# EAGLE schematic LCDShieldC144MVGD v1 (EAGLE 5.11)
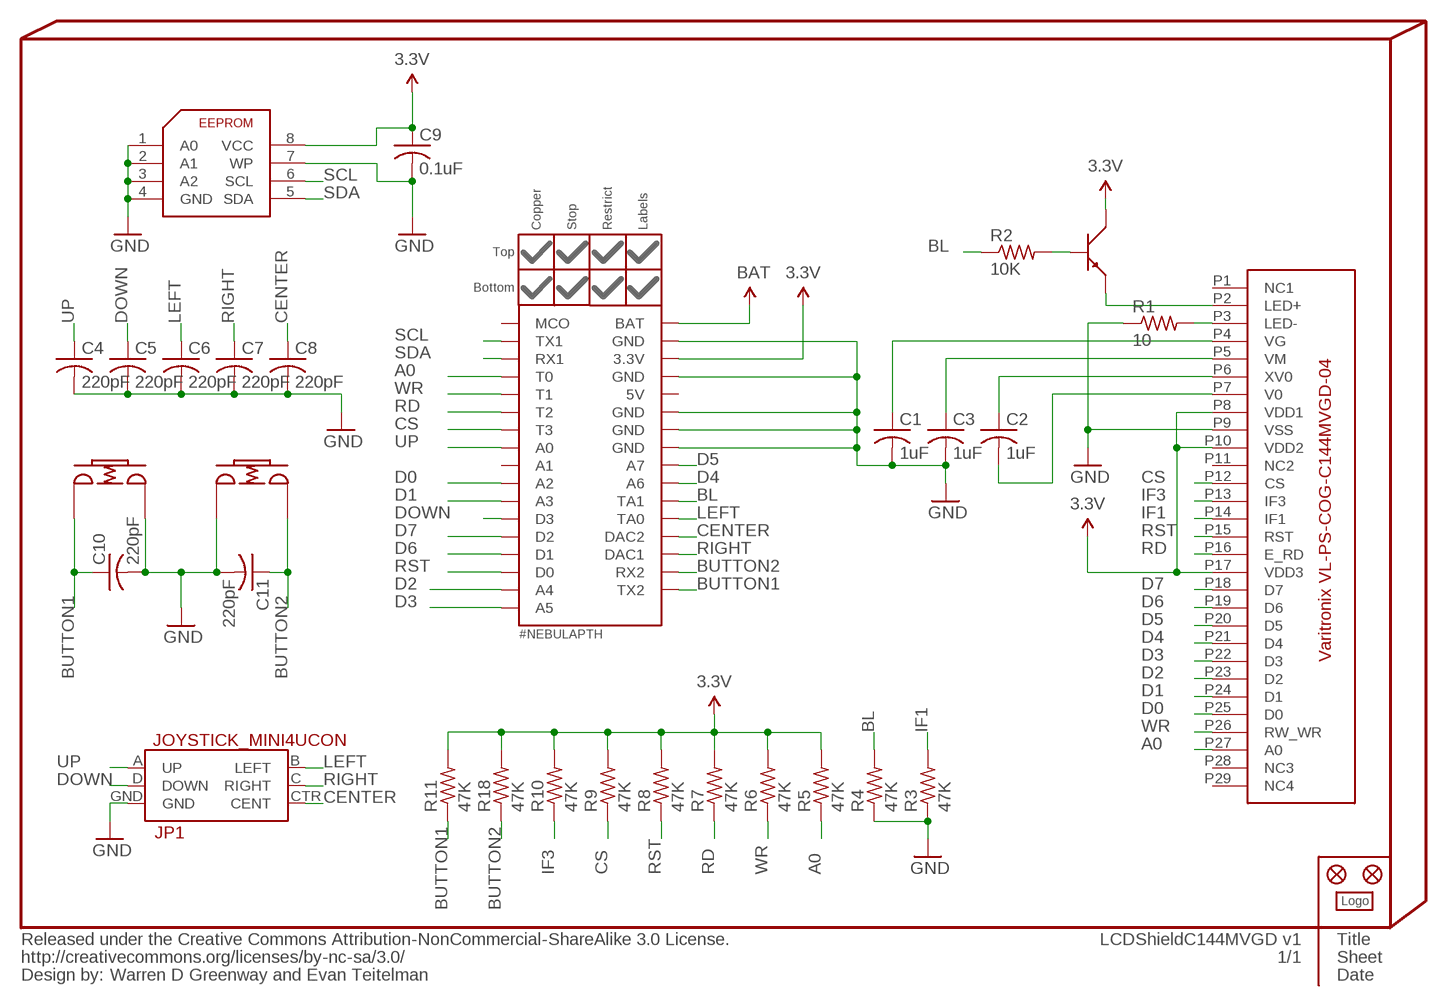
[diagram p0: schematic, sheet 1]

## Parts
C1  1uF  C-USC0402  [C0402]
C2  1uF  C-USC0402  [C0402]
C3  1uF  C-USC0402  [C0402]
C4  220pF  C-USC0402  [C0402]
C5  220pF  C-USC0402  [C0402]
C6  220pF  C-USC0402  [C0402]
C7  220pF  C-USC0402  [C0402]
C8  220pF  C-USC0402  [C0402]
C9  0.1uF  C-USC0402  [C0402]
C10  220pF  C-USC0402  [C0402]
C11  220pF  C-USC0402  [C0402]
INFO3  Warren D Greenway and Evan Teitelman  %CC-NC-SA  [%CC-NC-SA]
JP1  JOYSTICK_MINI4UCON  [JOYSTICK_MINI]
JP2  FIDUCIAL1X2.5  [FIDUCIAL-1X2.5]
JP3  FIDUCIAL1X2.5  [FIDUCIAL-1X2.5]
LOGO1  #PYGMYLOGOLARGE  [#PYGMYLOGO]
NEBULA1  #NEBULAPTH  [#NEBULA-PTH]
R1  10  R-US_R0805  [R0805]
R2  10K  R-US_R0402  [R0402]
R3  47K  R-US_R0402  [R0402]
R4  47K  R-US_R0402  [R0402]
R5  47K  R-US_R0402  [R0402]
R6  47K  R-US_R0402  [R0402]
R7  47K  R-US_R0402  [R0402]
R8  47K  R-US_R0402  [R0402]
R9  47K  R-US_R0402  [R0402]
R10  47K  R-US_R0402  [R0402]
R11  47K  R-US_R0402  [R0402]
R18  47K  R-US_R0402  [R0402]
U1  VARITRONIX_VL-PS-COG-C144MVGD-04FOLDED  [VARITRONIX_C144MVGD_FOLDED]
U2  BIPOLAR-PMBT6428  [DUBLIB_SOT23]
U3  EEPROM-ATMEL-AT24HC02B  [TSSOP8]
U4  SWITCH-ALPS-SKRG  [SWITCH-2P-5MM]
U5  SWITCH-ALPS-SKRG  [SWITCH-2P-5MM]

## Nets
3.3V: C9.1 NEBULA1.3.3V R5.2 R6.2 R7.2 R8.2 R9.2 R10.2 R11.2 R18.2 U1.P8(VDD1) U1.P10(VDD2) U1.P17(VDD3) U2.3 U3.8(VCC) ; supply symbol labelled @3.3V
A0: NEBULA1.T0 R5.1 U1.P27(A0)
BAT: NEBULA1.BAT ; supply symbol labelled @BAT
BL: NEBULA1.TA1 R2.1 R4.2
BUTTON1: C10.1 NEBULA1.COM2_TX(TX2) R11.1 U4.P1
BUTTON2: C11.1 NEBULA1.COM2_RX(RX2) R18.1 U5.P2
CENTER: C8.1 JP1.CTR(CENT) NEBULA1.DAC2
CS: NEBULA1.T3 R9.1 U1.P12(CS)
D0: NEBULA1.A2 U1.P25(D0)
D1: NEBULA1.A3 U1.P24(D1)
D2: NEBULA1.A4 U1.P23(D2)
D3: NEBULA1.A5 U1.P22(D3)
D4: NEBULA1.A6 U1.P21(D4)
D5: NEBULA1.A7 U1.P20(D5)
D6: NEBULA1.D1 U1.P19(D6)
D7: NEBULA1.D2 U1.P18(D7)
DOWN: C5.1 JP1.D(DOWN) NEBULA1.D3
GND: C1.2 C3.2 C4.2 C5.2 C6.2 C7.2 C8.2 C9.2 C10.2 C11.2 JP1.GND NEBULA1.GND1(GND) NEBULA1.GND2(GND) NEBULA1.GND3(GND) NEBULA1.GND4(GND) NEBULA1.GND5(GND) R1.1 R3.1 R4.1 U1.P9(VSS) U3.1(A0) U3.2(A1) U3.3(A2) U3.4(GND) U3.7(WP) U4.P2 U5.P1 ; supply symbol labelled @GND
IF1: R3.2 U1.P14(IF1)
IF3: R10.1 U1.P13(IF3)
LEFT: C6.1 JP1.B(LEFT) NEBULA1.TA0
N$1: C1.1 U1.P4(VG)
N$2: C3.1 U1.P5(VM)
N$3: C2.1 U1.P6(XV0)
N$4: C2.2 U1.P7(V0)
N$5: R1.2 U1.P3(LED-)
N$6: U1.P2(LED+) U2.2
N$7: R2.2 U2.1
RD: NEBULA1.T2 R7.1 U1.P16(E_RD)
RIGHT: C7.1 JP1.C(RIGHT) NEBULA1.DAC1
RST: NEBULA1.D0 R8.1 U1.P15(RST)
SCL: NEBULA1.COM1_TX(TX1) U3.6(SCL)
SDA: NEBULA1.COM1_RX(RX1) U3.5(SDA)
UP: C4.1 JP1.A(UP) NEBULA1.A0
WR: NEBULA1.T1 R6.1 U1.P26(RW_WR)
Unconnected: NEBULA1.5V NEBULA1.A1 NEBULA1.MCO U1.P1(NC1) U1.P11(NC2) U1.P28(NC3) U1.P29(NC4)

## Library data of the parts
C1-C11 = rcl:C-US: CAPACITOR, American symbol
INFO3 = PygmyBoards:%CC-NC-SA: Released under the Creative Commons Attribution-NonCommercial-ShareAlike 3.0 License. http://creativecommons.org/licenses/by-sa/3.0 Design by: [Designer Name] Change this part's value to change the designer name
JP1 = SparkFun:JOYSTICK_MINI
JP2 JP3 = SparkFun:FIDUCIAL: Fiducial Alignment Points Various fiducial points for machine vision alignment.
LOGO1 = Pygmy:#PYGMYLOGO
NEBULA1 = PygmyBoards:#NEBULA: Nebula Board and Shield Footprint Pads This is the only absolutely required part for the footprint. The parts in "#NEBULA-PART" are merely aesthetic. A circular board outline should be .001" thick and 1.005" in diameter (Reference circle on the Document (48) layer provided).
R1-R11 R18 = rcl:R-US_: RESISTOR, American symbol
U1 = Pygmy:VARITRONIX_VL-PS-COG-C144MVGD-04
U2 = Pygmy:BIPOLAR-PMBT6428
U3 = Pygmy:EEPROM-ATMEL-AT24HC02B
U4 U5 = Pygmy:SWITCH-ALPS-SKRG